# EAGLE schematic invert_amp_filters (EAGLE 6.4)
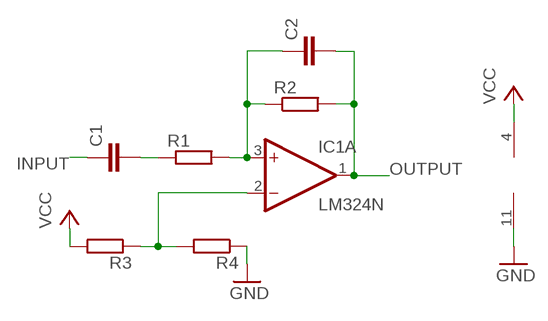
[diagram p0: schematic, sheet 1]

## Parts
C1  C-EU025-025X050  [C025-025X050]
C2  C-EU025-025X050  [C025-025X050]
IC1  LM324N  [DIL14]
R1  R-EU_0204/7  [0204/7]
R2  R-EU_0204/7  [0204/7]
R3  R-EU_0204/7  [0204/7]
R4  R-EU_0204/7  [0204/7]

## Nets
GND: IC1.11(P:V-) R4.1
INPUT: C1.1
N$1: C1.2 R1.1
N$2: C2.1 IC1.3(A:+IN) R1.2 R2.1
N$6: IC1.2(A:-IN) R3.1 R4.2
OUTPUT: C2.2 IC1.1(A:OUT) R2.2
VCC: IC1.4(P:V+) R3.2
Unconnected: IC1.5(B:+IN) IC1.6(B:-IN) IC1.7(B:OUT) IC1.8(C:OUT) IC1.9(C:-IN) IC1.10(C:+IN) IC1.12(D:+IN) IC1.13(D:-IN) IC1.14(D:OUT)

## Library data of the parts
C1 C2 = resistor:C-EU: CAPACITOR, European symbol
IC1 = linear:LM324: OP AMP
R1-R4 = resistor:R-EU_: RESISTOR, European symbol